# EAGLE design remote (EAGLE 9.1.0)
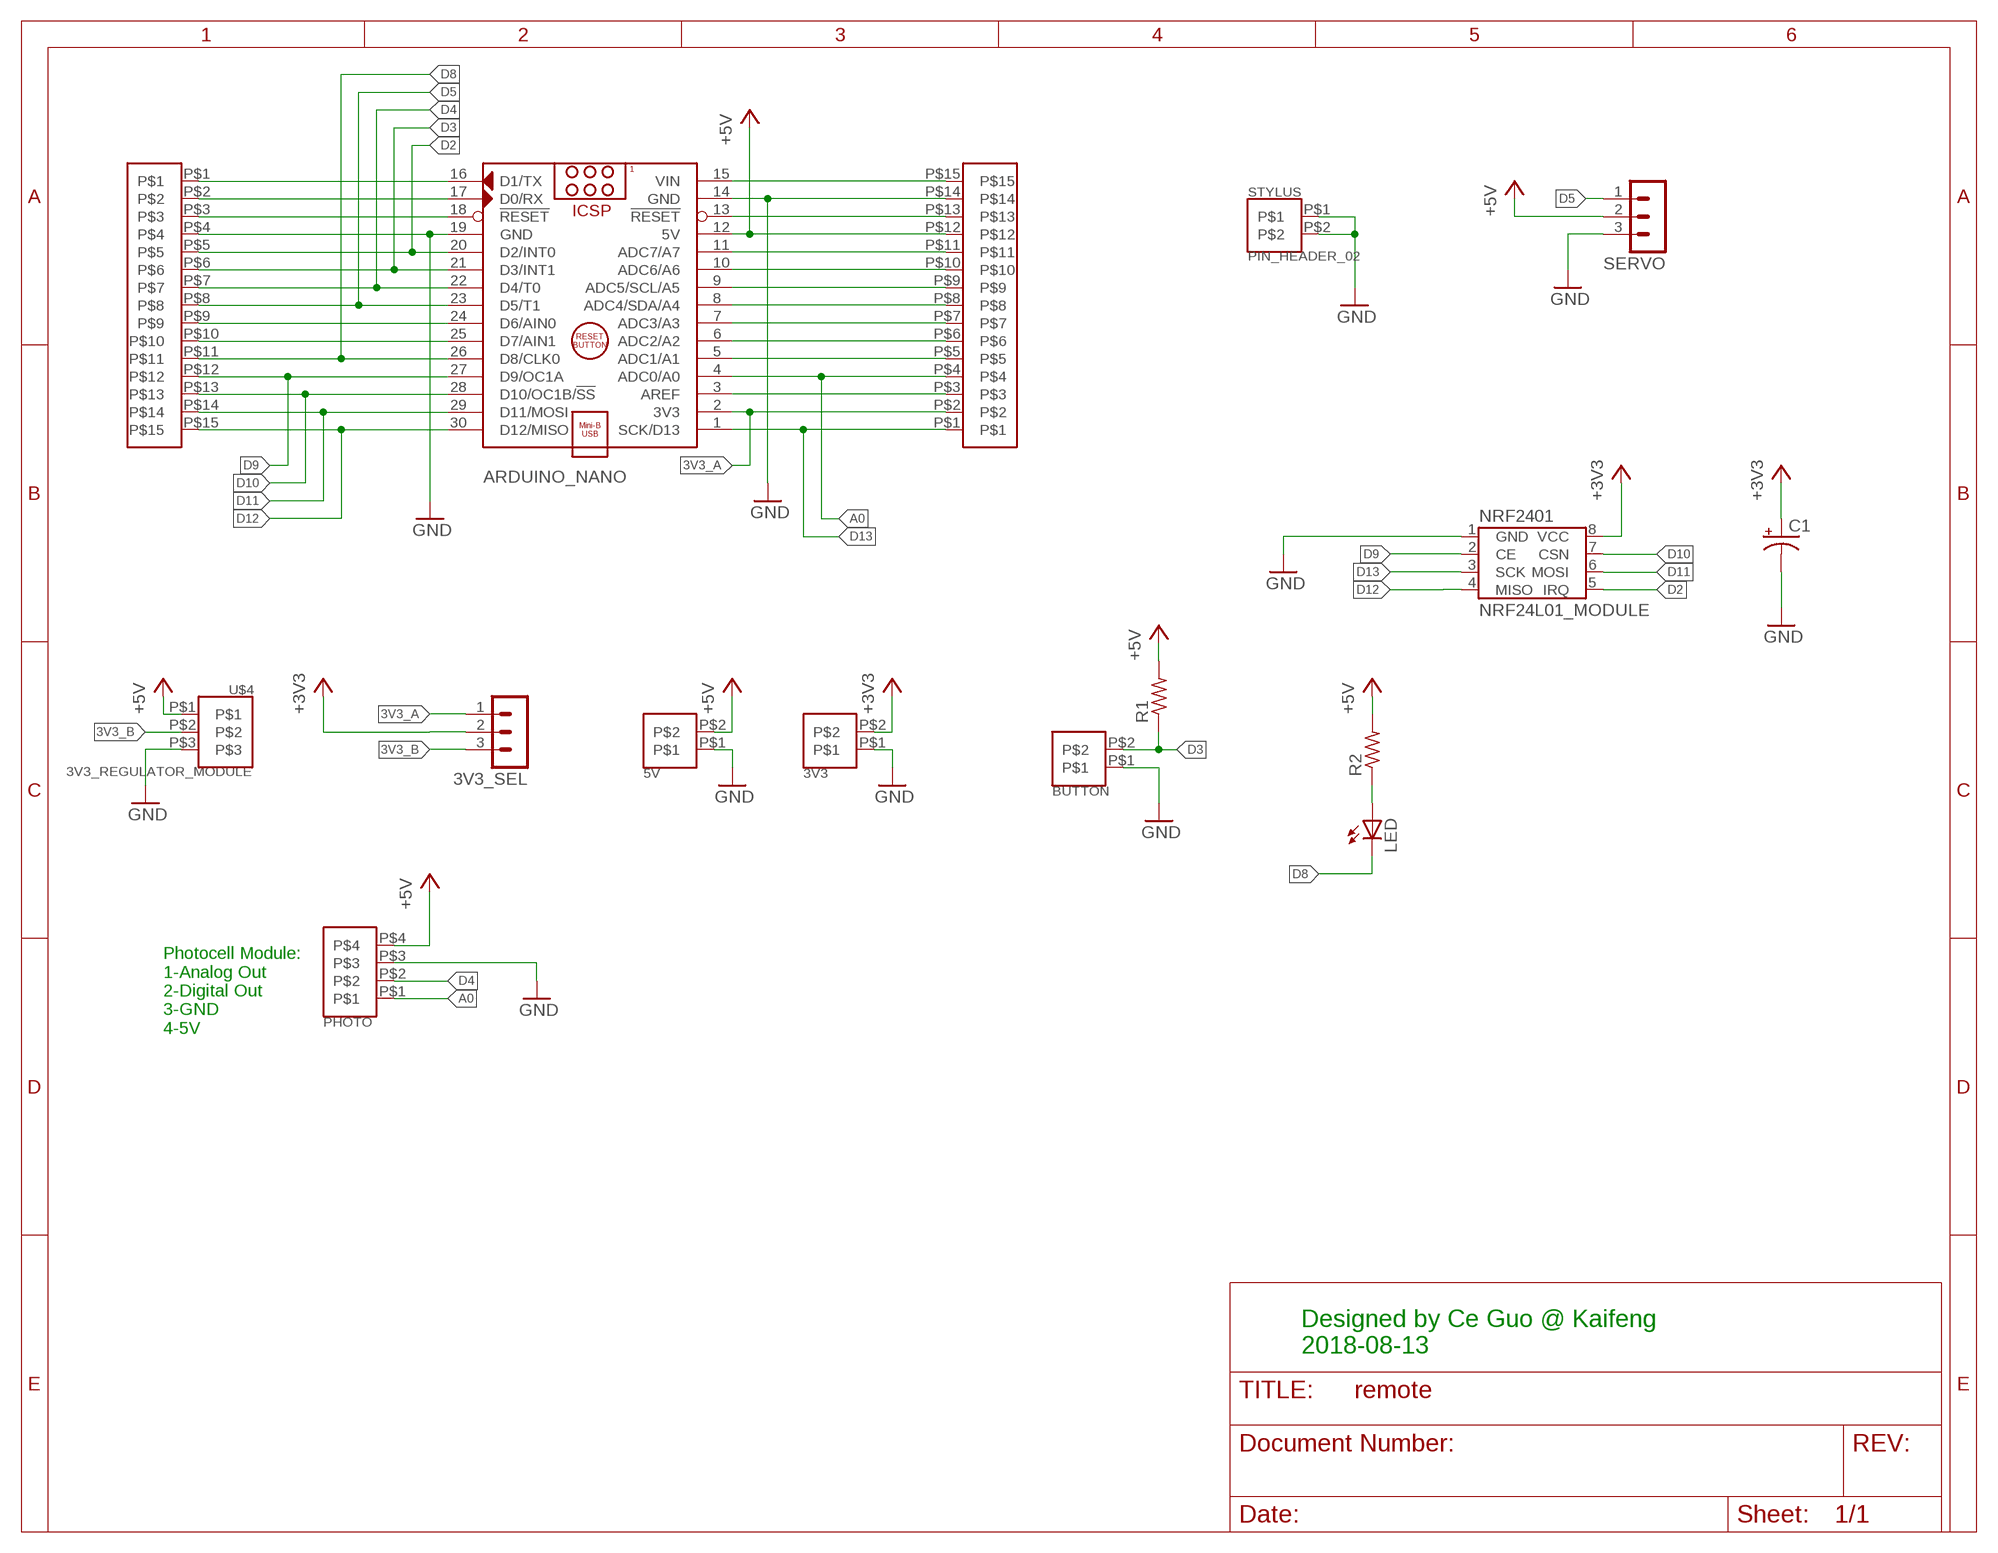
[diagram p0: schematic, sheet 1]

## Parts
3V3  PIN_HEADER_02  [PIN_HEADER_02]
3V3_SEL  MA03-1  [MA03-1]
5V  PIN_HEADER_02  [PIN_HEADER_02]
ARDUINO_NANO  ARDUINO_NANO_NO_HOLE  [ARDUINO_NANO_B]
BUTTON  PIN_HEADER_02  [PIN_HEADER_02]
C1  CPOL-USE5-5  [E5-5]
LED  LED_HEADER  [PIN_HEADER_02]
NRF2401  NRF24L01_MODULE  [NRF24_MODULE]
PHOTO  PIN_HEADER_04  [PIN_HEADER_04]
R1  R-US_R0805  [R0805]
R2  R-US_R0805  [R0805]
SERVO  MA03-1  [MA03-1]
STYLUS  PIN_HEADER_02  [PIN_HEADER_02]
U$2  PIN_HEADER_15  [PIN_HEADER_15]
U$3  PIN_HEADER_15  [PIN_HEADER_15]
U$4  3V3_REGULATOR_MODULE  [3V3_REGULATOR_MODULE]

## Nets
3V3_A: 3V3_SEL.1 ARDUINO_NANO.2(3V3) U$3.P$2
3V3_B: 3V3_SEL.3 U$4.P$2
+3V3: 3V3.P$2 3V3_SEL.2 C1.+ NRF2401.8(VCC)
+5V: 5V.P$2 ARDUINO_NANO.12(5V) PHOTO.P$4 R1.2 R2.2 SERVO.2 U$3.P$12 U$4.P$1
A0: ARDUINO_NANO.4(ADC0/A0) PHOTO.P$1 U$3.P$4
D2: ARDUINO_NANO.20(D2/INT0) NRF2401.5(IRQ) U$2.P$5
D3: ARDUINO_NANO.21(D3/INT1) BUTTON.P$2 R1.1 U$2.P$6
D4: ARDUINO_NANO.22(D4/T0) PHOTO.P$2 U$2.P$7
D5: ARDUINO_NANO.23(D5/T1) SERVO.1 U$2.P$8
D8: ARDUINO_NANO.26(D8/CLK0) LED.P$2(C) U$2.P$11
D9: ARDUINO_NANO.27(D9/OC1A) NRF2401.2(CE) U$2.P$12
D10: ARDUINO_NANO.28(D10/OC1B/!SS) NRF2401.7(CSN) U$2.P$13
D11: ARDUINO_NANO.29(D11/MOSI) NRF2401.6(MOSI) U$2.P$14
D12: ARDUINO_NANO.30(D12/MISO) NRF2401.4(MISO) U$2.P$15
D13: ARDUINO_NANO.1(SCK/D13) NRF2401.3(SCK) U$3.P$1
GND: 3V3.P$1 5V.P$1 ARDUINO_NANO.14(GND) ARDUINO_NANO.19(GND) BUTTON.P$1 C1.- NRF2401.1(GND) PHOTO.P$3 SERVO.3 STYLUS.P$1 STYLUS.P$2 U$2.P$4 U$3.P$14 U$4.P$3
N$1: ARDUINO_NANO.16(D1/TX) U$2.P$1
N$2: ARDUINO_NANO.17(D0/RX) U$2.P$2
N$3: ARDUINO_NANO.18(!RESET) U$2.P$3
N$4: LED.P$1(A) R2.1
N$9: ARDUINO_NANO.24(D6/AIN0) U$2.P$9
N$10: ARDUINO_NANO.25(D7/AIN1) U$2.P$10
N$18: ARDUINO_NANO.3(AREF) U$3.P$3
N$20: ARDUINO_NANO.5(ADC1/A1) U$3.P$5
N$21: ARDUINO_NANO.6(ADC2/A2) U$3.P$6
N$22: ARDUINO_NANO.7(ADC3/A3) U$3.P$7
N$23: ARDUINO_NANO.8(ADC4/SDA/A4) U$3.P$8
N$24: ARDUINO_NANO.9(ADC5/SCL/A5) U$3.P$9
N$25: ARDUINO_NANO.10(ADC6/A6) U$3.P$10
N$26: ARDUINO_NANO.11(ADC7/A7) U$3.P$11
N$28: ARDUINO_NANO.13(!RESET) U$3.P$13
N$30: ARDUINO_NANO.15(VIN) U$3.P$15

## Notes on the sheet
- Photocell Module:
  1-Analog Out
  2-Digital Out
  3-GND
  4-5V
- Designed by Ce Guo @ Kaifeng
  2018-08-13

## Library data of the parts
3V3 5V BUTTON STYLUS = Modules:PIN_HEADER_02
3V3_SEL SERVO = con-lstb:MA03-1: PIN HEADER; OC_FARNELL: unknown; OC_NEWARK: unknown
ARDUINO_NANO = ArduinoNanoV30:ARDUINO_NANO: Arduino Nano V3.0 Module Overview: The Arduino Nano is a small, complete, and breadboard-friendly board based on the ATmega328 (Arduino Nano 3.x) or ATmega168 (Arduino Nano 2.x). It has more or less the same functionality of the Arduino Duemilanove, but in a different package. It lacks only a DC power jack, and works with a Mini-B USB cable instead of a standard one. The Nano was designed and is being produced by Gravitech <http://www.gravitech.us/arna30wiatp.html>. General specifications: Item Value Microcontroller Atmel ATmega168 or ATmega328 Operating Voltage (logic level) 5 V Input Voltage (recommended) 7-12 V Input Voltage (limits) 6-20 V Digital I/O Pins 14 (of which 6 provide PWM output) Analog Input Pins 8 DC Current per I/O Pin 40 mA Flash Memory 16 KB (ATmega168) or 32 KB (ATmega328) of which 2 KB used by bootloader SRAM 1 KB (ATmega168) or 2 KB (ATmega328) EEPROM 512 bytes (ATmega168) or 1 KB (ATmega328) Clock Speed 16 MHz Dimensions (Inches) 0.73" x 1.70" Dimensions (mm) 18mm x 45mm Overall height About 9 mm (not including pins) Weigth 5 g Power: The Arduino Nano can be powered via the Mini-B USB connection, 6-20V unregulated external power supply (pin 30), or 5V regulated external power supply (pin 27). The power source is automatically selected to the highest voltage source. Memory: The ATmega168 has 16 KB of flash memory for storing code (of which 2 KB is used for the bootloader); the ATmega328 has 32 KB, (also with 2 KB used for the bootloader). The ATmega168 has 1 KB of SRAM and 512 bytes of EEPROM (which can be read and written with the EEPROM library); the ATmega328 has 2 KB of SRAM and 1 KB of EEPROM. Input and Output: Each of the 14 digital pins on the Nano can be used as an input or output, using pinMode(), digitalWrite(), and digitalRead() functions. They operate at 5 volts. Each pin can provide or receive a maximum of 40 mA and has an internal pull-up resistor (disconnected by default) of 20-50 kOhms. In addition, some pins have specialized functions. Visit Arduino - ArduinoBoardNano <https://www.arduino.cc/en/Main/ArduinoBoardNano>
C1 = adafruit:CPOL-US: POLARIZED CAPACITOR, American symbol
LED = Modules:LED_HEADER
NRF2401 = Modules:NRF24L01_MODULE: nRF24L01 module for 2.4G wireless transmission.
PHOTO = Modules:PIN_HEADER_04
R1 R2 = adafruit:R-US_: RESISTOR, American symbol
U$2 U$3 = Modules:PIN_HEADER_15
U$4 = Modules:3V3_REGULATOR_MODULE

## Board
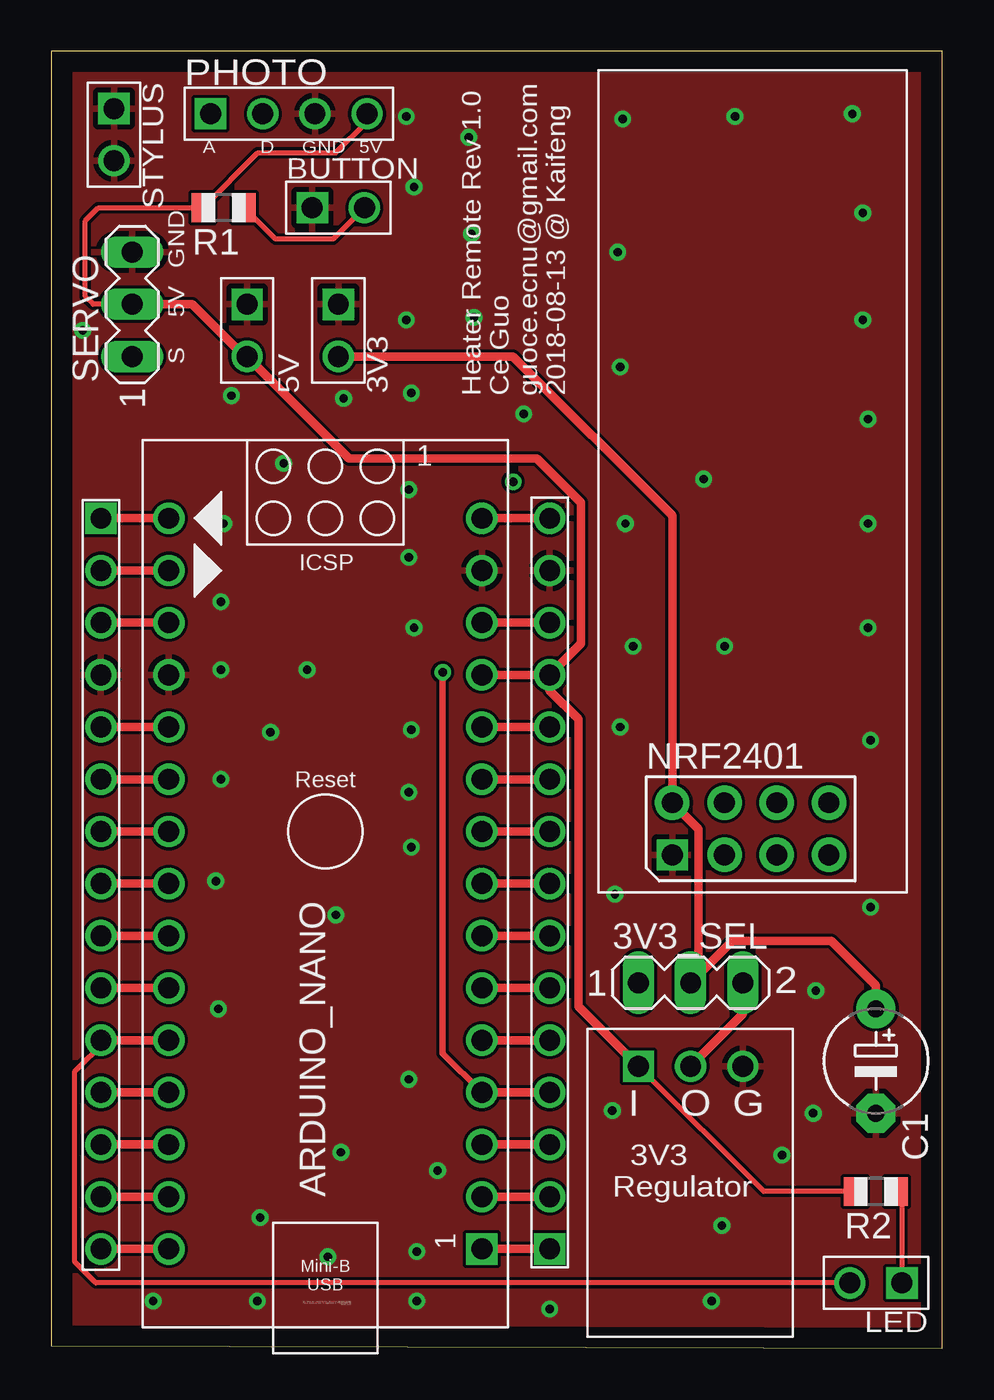
[diagram p1: board, top side]
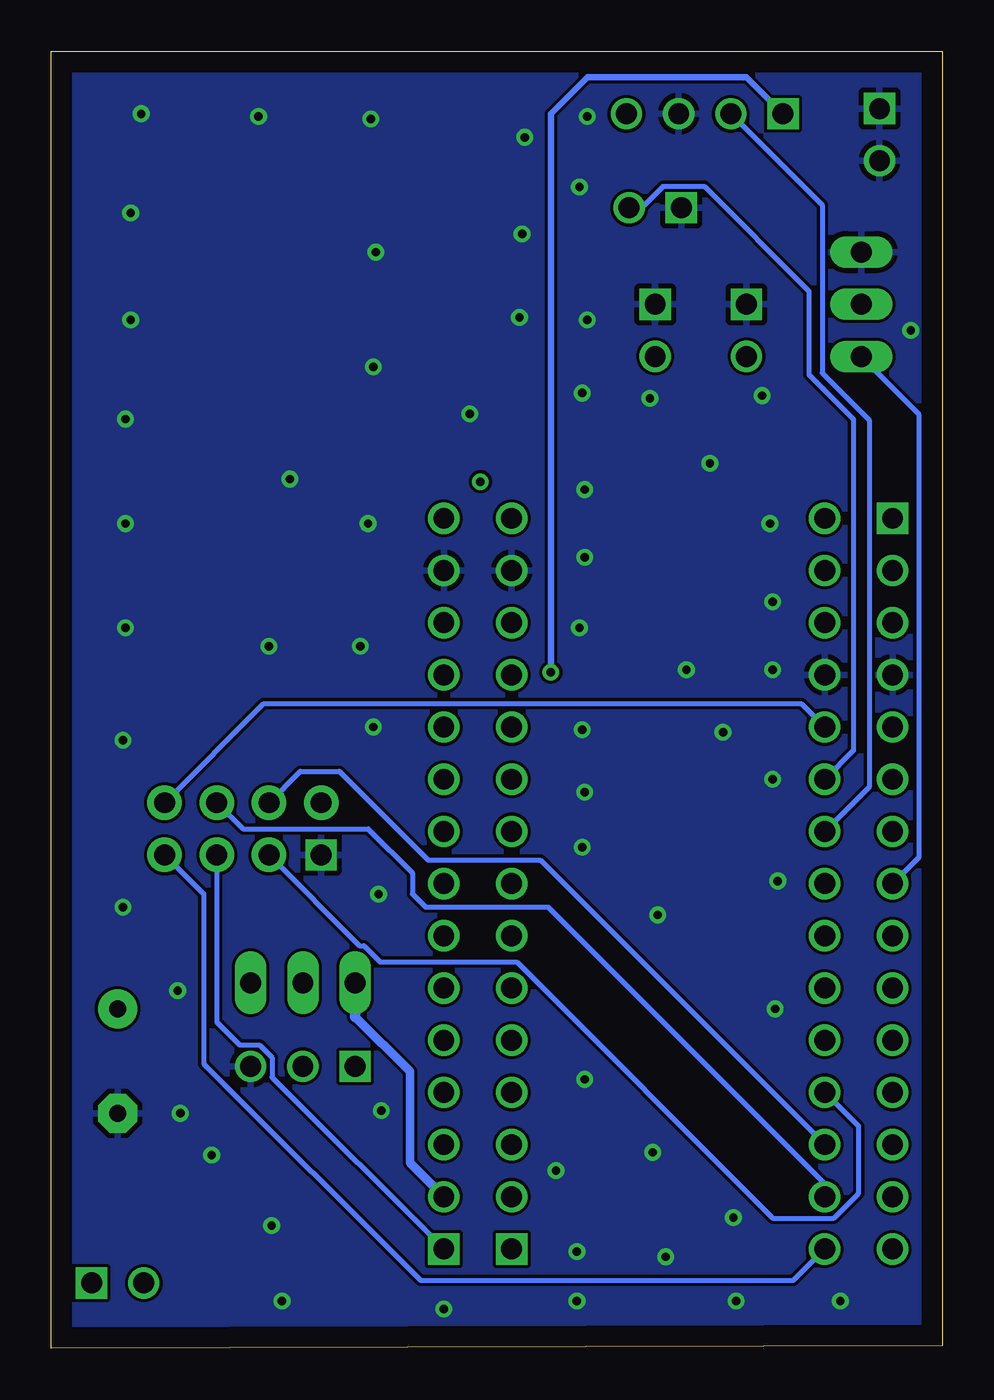
[diagram p2: board, bottom side, seen from below]

Size 43.36 x 63.11 mm. Coordinates in mm from the lower left corner, seen from the top.
Outline: 0,0.13 43.36,0 43.36,63.11 0,63.11 0,0.13
Copper layers (1*16): Top 0.035mm / dielectric 1.5mm / Bottom 0.035mm
Design rules "default": minimum track width 6mil, minimum drill 0.35mm, track to track 6mil, track to pad 6mil, pad to pad 6mil, via to via 6mil, smd to smd 6mil, copper to edge 40mil, drill to drill 6mil, minimum pad ring 10mil, minimum via ring 8mil, stop-mask expansion 4mil, vias tented up to drill 0mil, thermal gap 10mil

### Footprints (pad centres in the part's own frame; a part is rotated, then mirrored left to right if it is on the bottom)
PIN_HEADER_02 = drill 1.016 square: P$1 0,0 | drill 1.016: P$2 2.54,0
MA03-1 = drill 1.016 long: 1 -2.54,0; 2 0,0; 3 2.54,0
ARDUINO_NANO_B = drill 1.016 square: 1 -20.32,-7.62 | drill 1.016: 2 -17.78,-7.62; 3 -15.24,-7.62; 4 -12.7,-7.62; 5 -10.16,-7.62; 6 -7.62,-7.62; 7 -5.08,-7.62; 8 -2.54,-7.62; 9 0,-7.62; 10 2.54,-7.62; 11 5.08,-7.62; 12 7.62,-7.62; 13 10.16,-7.62; 14 12.7,-7.62; 15 15.24,-7.62; 16 15.24,7.62; 17 12.7,7.62; 18 10.16,7.62; 19 7.62,7.62; 20 5.08,7.62; 21 2.54,7.62; 22 0,7.62; 23 -2.54,7.62; 24 -5.08,7.62; 25 -7.62,7.62; 26 -10.16,7.62; 27 -12.7,7.62; 28 -15.24,7.62; 29 -17.78,7.62; 30 -20.32,7.62
E5-5 = drill 0.813 pad 1.905: + -2.54,0 | drill 0.813 pad 1.905 octagon: - 2.54,0
NRF24_MODULE = drill 1.016 square: 1 -3.81,-1.27 | drill 1.016 pad 1.676: 2 -1.27,-1.27; 3 1.27,-1.27; 4 3.81,-1.27; 5 3.81,1.27; 6 1.27,1.27; 7 -1.27,1.27; 8 -3.81,1.27
PIN_HEADER_04 = drill 1.016 square: P$1 -3.81,0 | drill 1.016: P$2 -1.27,0; P$3 1.27,0; P$4 3.81,0
R0805 = smd 1.1 x 1.4: 1 -1,0; 2 1,0
PIN_HEADER_15 = drill 1.016 square: P$1 -17.78,0 | drill 1.016: P$2 -15.24,0; P$3 -12.7,0; P$4 -10.16,0; P$5 -7.62,0; P$6 -5.08,0; P$7 -2.54,0; P$8 0,0; P$9 2.54,0; P$10 5.08,0; P$11 7.62,0; P$12 10.16,0; P$13 12.7,0; P$14 15.24,0; P$15 17.78,0
3V3_REGULATOR_MODULE = drill 1.016 square: P$1 -2.54,0 | drill 1.016: P$2 0,0; P$3 2.54,0

### Placement (x,y rotation side)
3V3  13.97,50.8 270 top
3V3_SEL  31.11,17.78 0 top
5V  9.53,50.8 270 top
ARDUINO_NANO  13.34,25.15 90 top
BUTTON  12.7,55.5 0 top
C1  40.13,13.97 270 top
LED  41.4,3.17 180 top
NRF2401  34.04,25.27 0 top
PHOTO  11.56,60.07 0 top
R1  8.38,55.5 180 top
R2  40.13,7.62 180 top
SERVO  3.94,50.8 90 top
STYLUS  3.05,60.33 270 top
U$2  2.41,22.61 270 top
U$3  24.26,22.61 90 top
U$4  31.11,13.72 0 top

### Tracks (layer width: path | path; a pad name or v marks a point on that pad's centre or on a via)
3V3_A
  Top 0.406: ARDUINO_NANO.2 U$3.P$2
  Bottom 0.406: U$3.P$2 25.91,9.02 25.91,13.46 28.57,16.13
  Bottom 0.508: 28.57,16.13 3V3_SEL.1
3V3_B
  Top 0.406: 3V3_SEL.3 33.66,16.26 U$4.P$2
+3V3
  Top 0.406: 3V3.P$2 22.48,48.26 30.23,40.51 NRF2401.8 31.5,25.27 31.5,18.16 3V3_SEL.2 33.15,19.81 37.97,19.81 40.13,17.65 C1.+
+5V
  Top 0.254: PHOTO.P$4 15.37,59.69 13.84,58.17 10.05,58.17 R1.2 2.29,55.5 1.65,54.86 1.65,51.18 2.03,50.8 SERVO.2 | R2.2 34.67,7.62 28.7,13.59 U$4.P$1
  Top 0.406: U$3.P$12 ARDUINO_NANO.12 | SERVO.2 6.86,50.8 9.4,48.26 5V.P$2 14.49,43.29 23.64,43.29 25.78,41.15 25.78,34.29 U$3.P$12 | U$3.P$12 24.26,32 25.65,30.61 25.65,16.64 28.7,13.59
A0  (via drill 0.41)
  Top 0.305: v19.05,32.89 19.05,14.35 ARDUINO_NANO.4
  Top 0.406: ARDUINO_NANO.4 U$3.P$4
  Bottom 0.305: PHOTO.P$1 9.53,61.85 17.27,61.85 19.05,60.07 v19.05,32.89 19.05,32.77
D2
  Top 0.406: ARDUINO_NANO.20 U$2.P$5
  Bottom 0.254: NRF2401.5 33.02,31.37 6.86,31.37 ARDUINO_NANO.20
D3
  Top 0.254: BUTTON.P$2 13.72,53.98 10.91,53.98 R1.1
  Top 0.406: U$2.P$6 ARDUINO_NANO.21
  Bottom 0.254: BUTTON.P$2 14.62,55.5 13.58,56.54 11.58,56.54 6.48,51.44 6.48,47.37 4.32,45.21 4.32,29.08 ARDUINO_NANO.21
D4
  Top 0.406: U$2.P$7 ARDUINO_NANO.22
  Bottom 0.254: ARDUINO_NANO.22 4.45,26.42 3.56,27.3 3.56,45.16 5.84,47.45 5.84,55.63 PHOTO.P$2
D5
  Top 0.406: U$2.P$8 ARDUINO_NANO.23
  Bottom 0.254: SERVO.1 1.14,45.47 1.14,23.88 U$2.P$8
D8
  Top 0.254: LED.P$2 2.16,3.17 1.14,4.19 1.14,13.46 2.67,14.99
  Top 0.406: ARDUINO_NANO.26 2.67,14.99 U$2.P$11
D9
  Top 0.406: U$2.P$12 ARDUINO_NANO.27
  Bottom 0.254: NRF2401.2 28.35,19.58 28.14,19.58 27.36,18.8 20.7,18.8 8.23,6.33 5.28,6.33 4.06,7.54 4.06,10.79 ARDUINO_NANO.27
D10
  Top 0.406: ARDUINO_NANO.28 U$2.P$13
  Bottom 0.254: NRF2401.7 31.24,28.07 29.34,28.07 25.02,23.75 19.56,23.75 ARDUINO_NANO.28
D11
  Top 0.406: U$2.P$14 ARDUINO_NANO.29
  Bottom 0.254: NRF2401.6 34.04,25.27 27.94,25.27 25.78,23.11 25.78,22.1 25.15,21.46 19.18,21.46 5.71,8 ARDUINO_NANO.29
D12
  Top 0.406: U$2.P$15 ARDUINO_NANO.30
  Bottom 0.254: NRF2401.4 35.94,22.1 35.94,13.84 25.4,3.3 7.24,3.3 ARDUINO_NANO.30
D13
  Top 0.406: U$3.P$1 ARDUINO_NANO.1
  Bottom 0.254: NRF2401.3 35.31,15.88 34.19,14.76 33.22,14.76 32.61,14.15 32.61,13.18 U$3.P$1
GND  (via drill 0.41)
  other vias: 17.27,59.94 20.32,58.93 17.65,56.52 20.45,54.23 20.57,50.16 17.27,50.04 27.81,59.82 33.27,59.94 38.99,60.07 27.56,53.34 27.69,47.75 31.75,42.29 27.94,40.13 22.99,45.47 17.53,46.48 14.22,46.23 8.76,46.36 11.3,43.05 17.4,41.78 17.4,38.48 17.65,35.05 17.53,30.1 17.4,27.05 17.53,24.38 10.67,29.97 12.45,33.02 8.26,33.02 8.26,36.32 8.38,40.13 8.26,27.69 8,22.73 8.13,16.51 13.84,21.08 14.1,9.53 17.4,13.08 10.16,6.35 4.95,2.29 10.03,2.29 17.78,2.29 17.78,4.7 13.46,4.44 18.8,8.64 24.26,1.91 32.13,2.29 32.64,5.97 35.56,9.4 37.08,11.43 27.3,11.56 37.21,17.4 39.88,21.46 27.43,22.1 27.69,30.23 28.32,34.16 32.77,34.16 39.88,29.59 39.75,35.05 39.75,40.13 39.75,45.21 39.5,50.04 39.5,55.25 1.52,49.53
  pour Top: -1.27,63.88 -1.27,0.13 0.25,-1.4 44.7,-1.4 44.7,64.01 -0.76,64.01 -1.02,63.75 -1.14,63.63 -1.14,63.25
  pour Bottom: -1.91,64.13 -1.91,-0.13 0.76,-2.79 44.7,-2.79 45.72,-1.78 46.23,-1.27 46.23,64.9 -1.4,64.9 -1.52,64.77
N$1
  Top 0.406: ARDUINO_NANO.16 U$2.P$1
N$2
  Top 0.406: U$2.P$2 ARDUINO_NANO.17
N$3
  Top 0.406: U$2.P$3 ARDUINO_NANO.18
N$4
  Top 0.254: R2.1 41.4,7.35 LED.P$1
N$9
  Top 0.406: ARDUINO_NANO.24 U$2.P$9
N$10
  Top 0.406: U$2.P$10 ARDUINO_NANO.25
N$18
  Top 0.406: U$3.P$3 ARDUINO_NANO.3
N$20
  Top 0.406: ARDUINO_NANO.5 U$3.P$5
N$21
  Top 0.406: ARDUINO_NANO.6 U$3.P$6
N$22
  Top 0.406: ARDUINO_NANO.7 U$3.P$7
N$23
  Top 0.406: U$3.P$8 ARDUINO_NANO.8
N$24
  Top 0.406: ARDUINO_NANO.9 U$3.P$9
N$25
  Top 0.406: ARDUINO_NANO.10 U$3.P$10
N$26
  Top 0.406: ARDUINO_NANO.11 U$3.P$11
N$28
  Top 0.406: ARDUINO_NANO.13 U$3.P$13
N$30
  Top 0.406: ARDUINO_NANO.15 U$3.P$15
N$76  (via drill 0.41)
  other vias: 22.48,42.16

### Text on the board
tPlace: A | D | GND | 5V | GND | 5V | S | Heater Remote Rev 1.0 / Ce Guo / guoce.ecnu@gmail.com / 2018-08-13 @ Kaifeng | 2 | 3V3 / Regulator